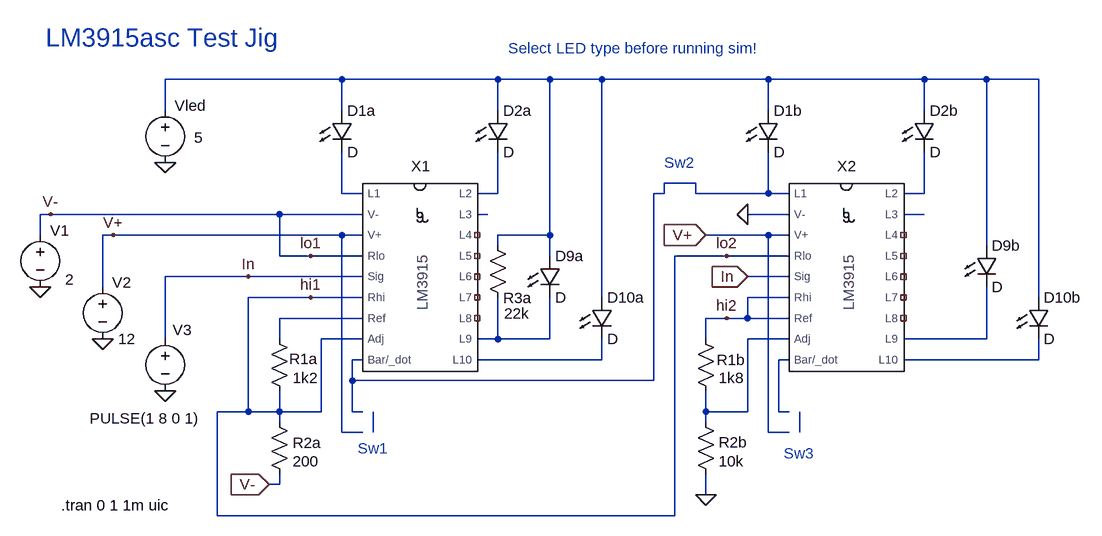
[diagram p0: schematic LM3915asc_Test.asc]
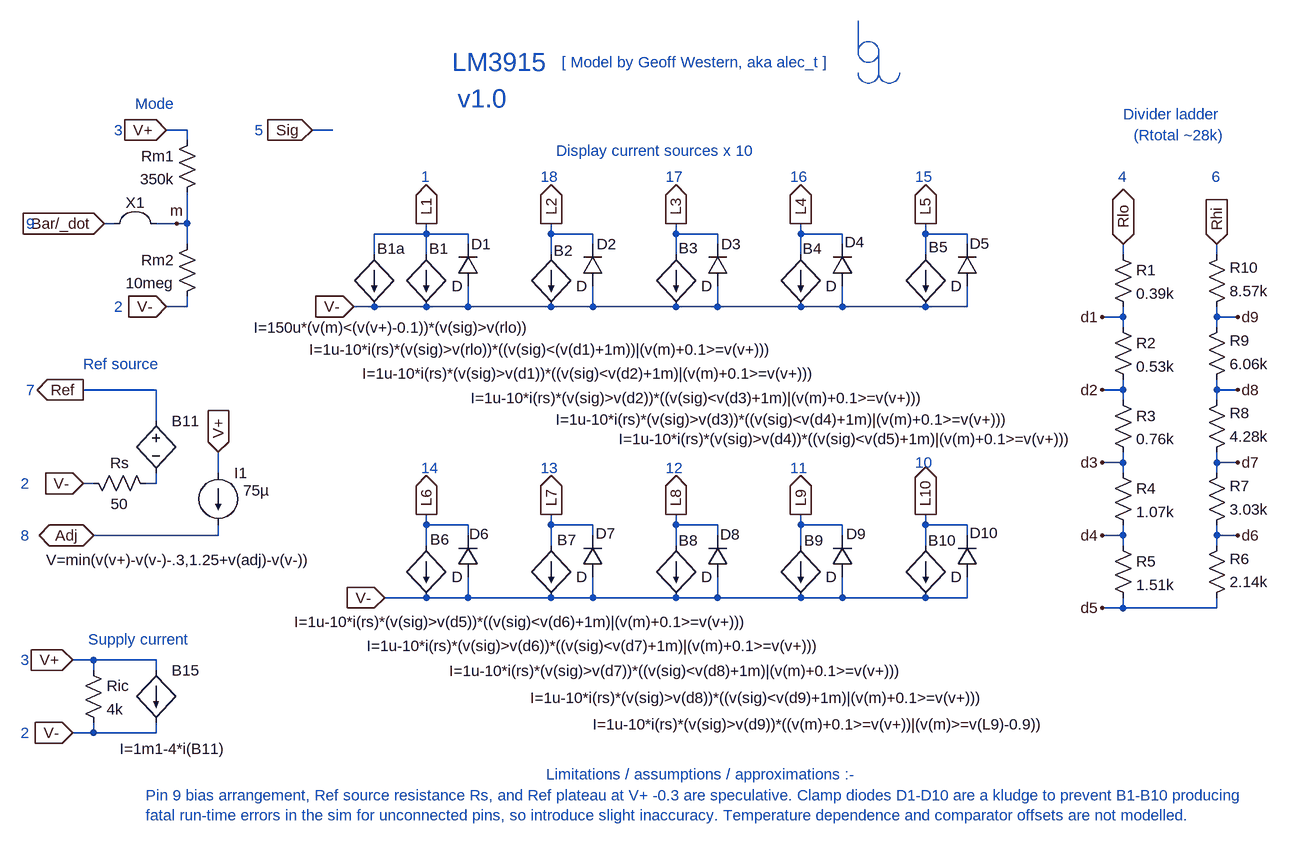
[diagram p1: sub-circuit lm3915asc.asc]
LM3915asc_Test.asc, the LTspice schematic file:
Version 4
SHEET 1 1496 692
WIRE 240 -112 -32 -112
WIRE 480 -112 240 -112
WIRE 560 -112 480 -112
WIRE 640 -112 560 -112
WIRE 896 -112 640 -112
WIRE 1136 -112 896 -112
WIRE 1232 -112 1136 -112
WIRE 1312 -112 1232 -112
WIRE -32 -64 -32 -112
WIRE 240 -64 240 -112
WIRE 480 -64 480 -112
WIRE 896 -64 896 -112
WIRE 1136 -64 1136 -112
WIRE 784 48 736 48
WIRE 240 64 240 0
WIRE 272 64 240 64
WIRE 480 64 480 0
WIRE 480 64 448 64
WIRE 736 64 736 48
WIRE 736 64 720 64
WIRE 784 64 784 48
WIRE 896 64 896 0
WIRE 896 64 784 64
WIRE 928 64 896 64
WIRE 1136 64 1136 0
WIRE 1136 64 1104 64
WIRE -208 96 -224 96
WIRE 144 96 -208 96
WIRE 272 96 144 96
WIRE 464 96 448 96
WIRE 928 96 864 96
WIRE 1136 96 1104 96
WIRE -224 128 -224 96
WIRE -112 128 -128 128
WIRE 240 128 -112 128
WIRE 272 128 240 128
WIRE 560 128 560 -112
WIRE 560 128 480 128
WIRE 896 128 800 128
WIRE 928 128 896 128
WIRE 480 144 480 128
WIRE 1232 144 1232 -112
WIRE 144 160 144 96
WIRE 192 160 144 160
WIRE 272 160 192 160
WIRE 560 160 560 128
WIRE 832 160 752 160
WIRE 928 160 832 160
WIRE 96 192 -32 192
WIRE 272 192 96 192
WIRE 928 192 864 192
WIRE -128 208 -128 128
WIRE 192 224 96 224
WIRE 272 224 192 224
WIRE 640 224 640 -112
WIRE 928 224 864 224
WIRE 1312 224 1312 -112
WIRE 272 256 144 256
WIRE 832 256 800 256
WIRE 864 256 864 224
WIRE 864 256 832 256
WIRE 928 256 864 256
WIRE -32 288 -32 192
WIRE 144 288 144 256
WIRE 272 288 208 288
WIRE 480 288 480 224
WIRE 480 288 448 288
WIRE 560 288 560 224
WIRE 560 288 480 288
WIRE 800 288 800 256
WIRE 928 288 864 288
WIRE 1232 288 1232 208
WIRE 1232 288 1104 288
WIRE 272 320 256 320
WIRE 640 320 640 288
WIRE 640 320 448 320
WIRE 928 320 912 320
WIRE 1312 320 1312 288
WIRE 1312 320 1104 320
WIRE 256 352 256 320
WIRE 720 352 720 64
WIRE 720 352 256 352
WIRE 96 400 96 224
WIRE 96 400 48 400
WIRE 144 400 144 368
WIRE 144 400 96 400
WIRE 208 400 208 288
WIRE 208 400 144 400
WIRE 256 400 256 352
WIRE 272 400 256 400
WIRE 800 400 800 368
WIRE 864 400 864 288
WIRE 864 400 800 400
WIRE 912 400 912 320
WIRE 928 400 912 400
WIRE 144 416 144 400
WIRE 800 416 800 400
WIRE 240 432 240 128
WIRE 272 432 240 432
WIRE 288 432 288 400
WIRE 896 432 896 128
WIRE 928 432 896 432
WIRE 944 432 944 400
WIRE 144 512 144 496
WIRE 144 512 128 512
WIRE 800 528 800 496
WIRE 48 560 48 400
WIRE 752 560 752 160
WIRE 752 560 48 560
FLAG -128 288 0
FLAG -32 368 0
FLAG 96 192 In
FLAG 192 224 hi1
FLAG 192 160 lo1
FLAG -224 208 0
FLAG -112 128 V+
FLAG 864 192 In
IOPIN 864 192 In
FLAG 832 256 hi2
FLAG -208 96 V-
FLAG 128 512 V-
IOPIN 128 512 In
FLAG 832 160 lo2
FLAG 864 96 0
FLAG 800 528 0
FLAG -32 16 0
FLAG 800 128 V+
IOPIN 800 128 In
SYMBOL voltage -128 192 R0
WINDOW 123 0 0 Left 2
WINDOW 39 0 0 Left 2
WINDOW 0 15 9 Left 2
SYMATTR InstName V2
SYMATTR Value 12
SYMBOL voltage -32 272 R0
WINDOW 3 -116 138 Left 2
WINDOW 123 0 0 Left 2
WINDOW 39 0 0 Left 2
WINDOW 0 12 2 Left 2
SYMATTR Value PULSE(1 8 0 1)
SYMATTR InstName V3
SYMBOL res 128 272 R0
WINDOW 0 31 47 Left 2
SYMATTR InstName R1a
SYMATTR Value 1k2
SYMBOL res 128 400 R0
WINDOW 0 36 48 Left 2
SYMATTR InstName R2a
SYMATTR Value 200
SYMBOL voltage -224 112 R0
WINDOW 123 0 0 Left 2
WINDOW 39 0 0 Left 2
WINDOW 0 15 9 Left 2
WINDOW 3 38 84 Left 2
SYMATTR InstName V1
SYMATTR Value 2
SYMBOL res 464 128 R0
WINDOW 0 24 97 Left 2
WINDOW 3 26 121 Left 2
SYMATTR InstName R3a
SYMATTR Value 22k
SYMBOL res 784 272 R0
WINDOW 0 33 48 Left 2
SYMATTR InstName R1b
SYMATTR Value 1k8
SYMBOL res 784 400 R0
WINDOW 0 36 47 Left 2
SYMATTR InstName R2b
SYMATTR Value 10k
SYMBOL voltage -32 -80 R0
WINDOW 123 0 0 Left 2
WINDOW 39 0 0 Left 2
WINDOW 0 15 9 Left 2
WINDOW 3 45 58 Left 2
SYMATTR InstName Vled
SYMATTR Value 5
SYMBOL LM3915asc 368 256 R0
SYMATTR InstName X1
SYMBOL LM3915asc 1024 256 R0
SYMATTR InstName X2
SYMBOL LED 224 -64 R0
SYMATTR InstName D1a
SYMBOL LED 464 -64 R0
SYMATTR InstName D2a
SYMBOL LED 544 160 R0
SYMATTR InstName D9a
SYMBOL LED 880 -64 R0
SYMATTR InstName D1b
SYMBOL LED 1120 -64 R0
SYMATTR InstName D2b
SYMBOL LED 1216 144 R0
SYMATTR InstName D9b
SYMBOL LED 1296 224 R0
SYMATTR InstName D10b
SYMBOL LED 624 224 R0
SYMATTR InstName D10a
TEXT -192 544 Left 2 !.tran 0 1 1m uic
TEXT -216 -176 Left 4 ;LM3915asc Test Jig
TEXT 264 456 Left 2 ;Sw1
TEXT 736 16 Left 2 ;Sw2
TEXT 920 464 Left 2 ;Sw3
TEXT 496 -160 Left 2 ;Select LED type before running sim!

lm3915asc.asc, the sub-circuit schematic file:
Version 4
SHEET 1 1684 1036
WIRE -480 -240 -512 -240
WIRE -256 -240 -288 -240
WIRE -480 -224 -480 -240
WIRE -592 -96 -608 -96
WIRE -496 -96 -528 -96
WIRE -480 -96 -480 -144
WIRE -480 -96 -496 -96
WIRE -112 -80 -112 -96
WIRE -112 -80 -192 -80
WIRE -48 -80 -112 -80
WIRE 80 -80 80 -96
WIRE 144 -80 80 -80
WIRE 272 -80 272 -96
WIRE 336 -80 272 -80
WIRE 464 -80 464 -96
WIRE 528 -80 464 -80
WIRE 656 -80 656 -96
WIRE 720 -80 656 -80
WIRE -480 -64 -480 -96
WIRE -48 -64 -48 -80
WIRE 144 -64 144 -80
WIRE 336 -64 336 -80
WIRE 528 -64 528 -80
WIRE 720 -64 720 -80
WIRE -192 -48 -192 -80
WIRE -112 -48 -112 -80
WIRE 80 -48 80 -80
WIRE 272 -48 272 -80
WIRE 464 -48 464 -80
WIRE 656 -48 656 -80
WIRE 960 -48 960 -64
WIRE 1104 -48 1104 -64
WIRE -480 32 -480 16
WIRE -480 32 -512 32
WIRE -192 32 -224 32
WIRE -112 32 -192 32
WIRE -48 32 -48 0
WIRE -48 32 -112 32
WIRE 80 32 -48 32
WIRE 144 32 144 0
WIRE 144 32 80 32
WIRE 272 32 144 32
WIRE 336 32 336 0
WIRE 336 32 272 32
WIRE 464 32 336 32
WIRE 528 32 528 0
WIRE 528 32 464 32
WIRE 656 32 528 32
WIRE 720 32 720 0
WIRE 720 32 656 32
WIRE 960 48 960 32
WIRE 960 48 928 48
WIRE 1104 48 1104 32
WIRE 1136 48 1104 48
WIRE 960 64 960 48
WIRE 1104 64 1104 48
WIRE -528 160 -640 160
WIRE 960 160 960 144
WIRE 960 160 928 160
WIRE 1104 160 1104 144
WIRE 1136 160 1104 160
WIRE 960 176 960 160
WIRE 1104 176 1104 160
WIRE -528 208 -528 160
WIRE 960 272 960 256
WIRE 960 272 928 272
WIRE 1104 272 1104 256
WIRE 1136 272 1104 272
WIRE -432 288 -432 256
WIRE 960 288 960 272
WIRE 1104 288 1104 272
WIRE -624 304 -640 304
WIRE -528 304 -528 288
WIRE -528 304 -544 304
WIRE -112 368 -112 352
WIRE -48 368 -112 368
WIRE 80 368 80 352
WIRE 144 368 80 368
WIRE 272 368 272 352
WIRE 336 368 272 368
WIRE 464 368 464 352
WIRE 528 368 464 368
WIRE 656 368 656 352
WIRE 720 368 656 368
WIRE -432 384 -432 368
WIRE -432 384 -624 384
WIRE -48 384 -48 368
WIRE 144 384 144 368
WIRE 336 384 336 368
WIRE 528 384 528 368
WIRE 720 384 720 368
WIRE 960 384 960 368
WIRE 960 384 928 384
WIRE 1104 384 1104 368
WIRE 1136 384 1104 384
WIRE -112 400 -112 368
WIRE 80 400 80 368
WIRE 272 400 272 368
WIRE 464 400 464 368
WIRE 656 400 656 368
WIRE 960 400 960 384
WIRE 1104 400 1104 384
WIRE -112 480 -176 480
WIRE -48 480 -48 448
WIRE -48 480 -112 480
WIRE 80 480 -48 480
WIRE 144 480 144 448
WIRE 144 480 80 480
WIRE 272 480 144 480
WIRE 336 480 336 448
WIRE 336 480 272 480
WIRE 464 480 336 480
WIRE 528 480 528 448
WIRE 528 480 464 480
WIRE 656 480 528 480
WIRE 720 480 720 448
WIRE 720 480 656 480
WIRE 960 496 960 480
WIRE 960 496 928 496
WIRE 1104 496 1104 480
WIRE 1104 496 960 496
WIRE -624 576 -656 576
WIRE -528 576 -624 576
WIRE -624 592 -624 576
WIRE -528 592 -528 576
WIRE -624 688 -624 672
WIRE -624 688 -656 688
WIRE -528 688 -528 672
WIRE -528 688 -624 688
FLAG -288 -240 Sig
IOPIN -288 -240 In
FLAG 960 -64 Rlo
IOPIN 960 -64 BiDir
FLAG -112 -96 L1
IOPIN -112 -96 Out
FLAG -224 32 V-
IOPIN -224 32 In
FLAG 80 -96 L2
IOPIN 80 -96 Out
FLAG 272 -96 L3
IOPIN 272 -96 Out
FLAG 464 -96 L4
IOPIN 464 -96 Out
FLAG 656 -96 L5
IOPIN 656 -96 Out
FLAG -112 352 L6
IOPIN -112 352 Out
FLAG 80 352 L7
IOPIN 80 352 Out
FLAG 272 352 L8
IOPIN 272 352 Out
FLAG 464 352 L9
IOPIN 464 352 Out
FLAG 656 352 L10
IOPIN 656 352 Out
FLAG -640 160 Ref
IOPIN -640 160 Out
FLAG 1104 -64 Rhi
IOPIN 1104 -64 In
FLAG -608 -96 Bar/_dot
IOPIN -608 -96 In
FLAG -656 576 V+
IOPIN -656 576 In
FLAG -176 480 V-
IOPIN -176 480 In
FLAG -656 688 V-
IOPIN -656 688 In
FLAG -624 384 Adj
IOPIN -624 384 BiDir
FLAG -432 256 V+
IOPIN -432 256 In
FLAG -640 304 V-
IOPIN -640 304 In
FLAG -496 -96 m
FLAG -512 -240 V+
IOPIN -512 -240 In
FLAG -512 32 V-
IOPIN -512 32 In
FLAG 928 48 d1
FLAG 928 160 d2
FLAG 928 272 d3
FLAG 928 384 d4
FLAG 928 496 d5
FLAG 1136 384 d6
FLAG 1136 272 d7
FLAG 1136 160 d8
FLAG 1136 48 d9
SYMBOL bi -112 -48 R0
WINDOW 3 -180 146 Left 2
WINDOW 0 4 -9 Left 2
SYMATTR Value I=1u-10*i(rs)*(v(sig)>v(rlo))*((v(sig)<(v(d1)+1m))|(v(m)+0.1>=v(v+)))
SYMATTR InstName B1
SYMBOL bi 80 -48 R0
WINDOW 3 -291 183 Left 2
WINDOW 0 4 -6 Left 2
SYMATTR Value I=1u-10*i(rs)*(v(sig)>v(d1))*((v(sig)<v(d2)+1m)|(v(m)+0.1>=v(v+)))
SYMATTR InstName B2
SYMBOL bi 272 -48 R0
WINDOW 3 -316 221 Left 2
WINDOW 0 4 -10 Left 2
SYMATTR Value I=1u-10*i(rs)*(v(sig)>v(d2))*((v(sig)<v(d3)+1m)|(v(m)+0.1>=v(v+)))
SYMATTR InstName B3
SYMBOL bi 464 -48 R0
WINDOW 3 -377 254 Left 2
WINDOW 0 3 -9 Left 2
SYMATTR Value I=1u-10*i(rs)*(v(sig)>v(d3))*((v(sig)<v(d4)+1m)|(v(m)+0.1>=v(v+)))
SYMATTR InstName B4
SYMBOL bi 656 -48 R0
WINDOW 3 -472 284 Left 2
WINDOW 0 5 -12 Left 2
SYMATTR Value I=1u-10*i(rs)*(v(sig)>v(d4))*((v(sig)<v(d5)+1m)|(v(m)+0.1>=v(v+)))
SYMATTR InstName B5
SYMBOL bi -112 400 R0
WINDOW 3 -203 117 Left 2
WINDOW 0 6 -10 Left 2
SYMATTR Value I=1u-10*i(rs)*(v(sig)>v(d5))*((v(sig)<v(d6)+1m)|(v(m)+0.1>=v(v+)))
SYMATTR InstName B6
SYMBOL bi 80 400 R0
WINDOW 3 -284 154 Left 2
WINDOW 0 9 -9 Left 2
SYMATTR Value I=1u-10*i(rs)*(v(sig)>v(d6))*((v(sig)<v(d7)+1m)|(v(m)+0.1>=v(v+)))
SYMATTR InstName B7
SYMBOL bi 272 400 R0
WINDOW 3 -349 193 Left 2
WINDOW 0 4 -8 Left 2
SYMATTR Value I=1u-10*i(rs)*(v(sig)>v(d7))*((v(sig)<v(d8)+1m)|(v(m)+0.1>=v(v+)))
SYMATTR InstName B8
SYMBOL bi 464 400 R0
WINDOW 3 -416 234 Left 2
WINDOW 0 5 -8 Left 2
SYMATTR Value I=1u-10*i(rs)*(v(sig)>v(d8))*((v(sig)<v(d9)+1m)|(v(m)+0.1>=v(v+)))
SYMATTR InstName B9
SYMBOL bi 656 400 R0
WINDOW 3 -512 275 Left 2
WINDOW 0 4 -8 Left 2
SYMATTR Value I=1u-10*i(rs)*(v(sig)>v(d9))*((v(m)+0.1>=v(v+))|(v(m)>=v(L9)-0.9))
SYMATTR InstName B10
SYMBOL res -640 576 R0
SYMATTR InstName Ric
SYMATTR Value 4k
SYMBOL diode -32 0 R180
WINDOW 0 -20 64 Left 2
WINDOW 3 24 0 Left 2
SYMATTR InstName D1
SYMBOL diode 160 0 R180
WINDOW 0 -21 64 Left 2
WINDOW 3 24 0 Left 2
SYMATTR InstName D2
SYMBOL diode 352 0 R180
WINDOW 0 -20 64 Left 2
WINDOW 3 24 0 Left 2
SYMATTR InstName D3
SYMBOL diode 544 0 R180
WINDOW 0 -18 67 Left 2
WINDOW 3 24 0 Left 2
SYMATTR InstName D4
SYMBOL diode 736 0 R180
WINDOW 0 -19 65 Left 2
WINDOW 3 24 0 Left 2
SYMATTR InstName D5
SYMBOL diode -32 448 R180
WINDOW 0 -17 66 Left 2
WINDOW 3 24 0 Left 2
SYMATTR InstName D6
SYMBOL diode 160 448 R180
WINDOW 0 -19 67 Left 2
WINDOW 3 24 0 Left 2
SYMATTR InstName D7
SYMBOL diode 352 448 R180
WINDOW 0 -19 65 Left 2
WINDOW 3 24 0 Left 2
SYMATTR InstName D8
SYMBOL diode 544 448 R180
WINDOW 0 -21 66 Left 2
WINDOW 3 24 0 Left 2
SYMATTR InstName D9
SYMBOL diode 736 448 R180
WINDOW 0 -32 68 Left 2
WINDOW 3 24 0 Left 2
SYMATTR InstName D10
SYMBOL res -464 -80 M0
SYMATTR InstName Rm2
SYMATTR Value 10meg
SYMBOL current -432 288 R0
WINDOW 123 0 0 Left 2
WINDOW 39 0 0 Left 2
WINDOW 3 38 27 Left 2
SYMATTR Value 75µ
SYMATTR InstName I1
SYMBOL res -528 320 M270
WINDOW 3 0 56 VBottom 2
WINDOW 0 32 56 VTop 2
SYMATTR Value 50
SYMATTR InstName Rs
SYMBOL bv -528 192 R0
WINDOW 3 -169 230 Left 2
SYMATTR Value V=min(v(v+)-v(v-)-.3,1.25+v(adj)-v(v-))
SYMATTR InstName B11
SYMBOL bi -192 -48 R0
WINDOW 3 -186 112 Left 2
WINDOW 0 4 -9 Left 2
SYMATTR Value I=150u*(v(m)<(v(v+)-0.1))*(v(sig)>v(rlo))
SYMATTR InstName B1a
SYMBOL bi -528 592 R0
WINDOW 3 -56 121 Left 2
SYMATTR Value I=1m1-4*i(B11)
SYMATTR InstName B15
SYMBOL res -464 -240 M0
SYMATTR InstName Rm1
SYMATTR Value 350k
SYMBOL res 944 -64 R0
SYMATTR InstName R1
SYMATTR Value 0.39k
SYMBOL res 944 48 R0
SYMATTR InstName R2
SYMATTR Value 0.53k
SYMBOL res 944 160 R0
SYMATTR InstName R3
SYMATTR Value 0.76k
SYMBOL res 944 272 R0
SYMATTR InstName R4
SYMATTR Value 1.07k
SYMBOL res 944 384 R0
SYMATTR InstName R5
SYMATTR Value 1.51k
SYMBOL res 1088 496 M180
WINDOW 0 36 76 Left 2
WINDOW 3 36 40 Left 2
SYMATTR InstName R6
SYMATTR Value 2.14k
SYMBOL res 1088 384 M180
WINDOW 0 36 76 Left 2
WINDOW 3 36 40 Left 2
SYMATTR InstName R7
SYMATTR Value 3.03k
SYMBOL res 1088 272 M180
WINDOW 0 36 76 Left 2
WINDOW 3 36 40 Left 2
SYMATTR InstName R8
SYMATTR Value 4.28k
SYMBOL res 1088 160 M180
WINDOW 0 36 76 Left 2
WINDOW 3 36 40 Left 2
SYMATTR InstName R9
SYMATTR Value 6.06k
SYMBOL res 1088 48 M180
WINDOW 0 36 76 Left 2
WINDOW 3 36 40 Left 2
SYMATTR InstName R10
SYMATTR Value 8.57k
SYMBOL Misc\\jumper -560 -160 R0
SYMATTR InstName X1
TEXT -736 576 Left 2 ;3
TEXT -728 -96 Left 2 ;9
TEXT -376 -240 Left 2 ;5
TEXT -728 160 Left 2 ;7
TEXT 1096 -168 Left 2 ;6
TEXT -736 384 Left 2 ;8
TEXT 952 -168 Left 2 ;4
TEXT -72 -344 Left 4 ;LM3915
TEXT -120 -168 Left 2 ;1
TEXT 64 -168 Left 2 ;18
TEXT 256 -168 Left 2 ;17
TEXT 448 -168 Left 2 ;16
TEXT 640 -168 Left 2 ;15
TEXT -120 280 Left 2 ;14
TEXT 64 280 Left 2 ;13
TEXT 256 280 Left 2 ;12
TEXT 448 280 Left 2 ;11
TEXT 640 272 Left 2 ;10
TEXT -632 544 Left 2 ;Supply current
TEXT -736 688 Left 2 ;2
TEXT 72 752 Left 2 ;Limitations / assumptions / approximations :-
TEXT -736 304 Left 2 ;2
TEXT -544 784 Left 2 ;Pin 9 bias arrangement, Ref source resistance Rs, and Ref plateau at V+ -0.3 are speculative. Clamp diodes D1-D10 are a kludge to prevent B1-B10 producing\nfatal run-time errors in the sim for unconnected pins, so introduce slight inaccuracy. Temperature dependence and comparator offsets are not modelled.
TEXT 96 -344 Left 2 ;[ Model by Geoff Western, aka alec_t ]
TEXT -640 120 Left 2 ;Ref source
TEXT -560 -280 Left 2 ;Mode
TEXT 960 -264 Left 2 ;Divider ladder
TEXT 88 -208 Left 2 ;Display current sources x 10
TEXT -592 32 Left 2 ;2
TEXT -592 -240 Left 2 ;3
TEXT 976 -232 Left 2 ;(Rtotal ~28k)
TEXT -64 -288 Left 4 ;v1.0
LINE Normal 552 -408 552 -376
LINE Normal 552 -392 552 -360
LINE Normal 584 -360 584 -328
CIRCLE Normal 584 -344 552 -376
ARC Normal 552 -344 584 -312 554 -328 590 -328
ARC Normal 584 -344 616 -312 586 -328 622 -328

The netlist it stands for:
* LM3915asc_Test.asc
V2 V+ 0 12
V3 In 0 PULSE(1 8 0 1)
R1a N008 lo2 1k2
R2a lo2 V- 200
V1 V- 0 2
R3a N001 N009 22k
R1b hi2 N010 1k8
R2b N010 0 10k
Vled N001 0 5
XX1 N002 lo2 In V+ V- lo2 N003 N012 N004 N006 NC_01 NC_02 NC_03 NC_04 NC_05 N009 N008 V- lm3915asc
XX2 N013 hi2 In V+ 0 N010 N002 N014 N005 N007 NC_06 NC_07 NC_08 NC_09 NC_10 N011 hi2 lo2 lm3915asc
D1a N001 N003 D
D2a N001 N004 D
D9a N001 N009 D
D1b N001 N002 D
D2b N001 N005 D
D9b N001 N011 D
D10b N001 N014 D
D10a N001 N012 D

* block symbol definitions
.subckt lm3915asc Bar/_dot Rhi Sig V+ V- Adj L1 L10 L2 L3 L4 L5 L6 L7 L8 L9 Ref Rlo
B1 L1 V- I=1u-10*i(rs)*(v(sig)>v(rlo))*((v(sig)<(v(d1)+1m))|(v(m)+0.1>=v(v+)))
B2 L2 V- I=1u-10*i(rs)*(v(sig)>v(d1))*((v(sig)<v(d2)+1m)|(v(m)+0.1>=v(v+)))
B3 L3 V- I=1u-10*i(rs)*(v(sig)>v(d2))*((v(sig)<v(d3)+1m)|(v(m)+0.1>=v(v+)))
B4 L4 V- I=1u-10*i(rs)*(v(sig)>v(d3))*((v(sig)<v(d4)+1m)|(v(m)+0.1>=v(v+)))
B5 L5 V- I=1u-10*i(rs)*(v(sig)>v(d4))*((v(sig)<v(d5)+1m)|(v(m)+0.1>=v(v+)))
B6 L6 V- I=1u-10*i(rs)*(v(sig)>v(d5))*((v(sig)<v(d6)+1m)|(v(m)+0.1>=v(v+)))
B7 L7 V- I=1u-10*i(rs)*(v(sig)>v(d6))*((v(sig)<v(d7)+1m)|(v(m)+0.1>=v(v+)))
B8 L8 V- I=1u-10*i(rs)*(v(sig)>v(d7))*((v(sig)<v(d8)+1m)|(v(m)+0.1>=v(v+)))
B9 L9 V- I=1u-10*i(rs)*(v(sig)>v(d8))*((v(sig)<v(d9)+1m)|(v(m)+0.1>=v(v+)))
B10 L10 V- I=1u-10*i(rs)*(v(sig)>v(d9))*((v(m)+0.1>=v(v+))|(v(m)>=v(L9)-0.9))
Ric V+ V- 4k
D1 V- L1 D
D2 V- L2 D
D3 V- L3 D
D4 V- L4 D
D5 V- L5 D
D6 V- L6 D
D7 V- L7 D
D8 V- L8 D
D9 V- L9 D
D10 V- L10 D
Rm2 Bar/_dot V- 10meg
I1 V+ Adj 75µ
Rs N001 V- 50
B11 Ref N001 V=min(v(v+)-v(v-)-.3,1.25+v(adj)-v(v-))
B1a L1 V- I=150u*(v(m)<(v(v+)-0.1))*(v(sig)>v(rlo))
B15 V+ V- I=1m1-4*i(B11)
Rm1 V+ Bar/_dot 350k
R1 Rlo d1 0.39k
R2 d1 d2 0.53k
R3 d2 d3 0.76k
R4 d3 d4 1.07k
R5 d4 d5 1.51k
R6 d5 d6 2.14k
R7 d6 d7 3.03k
R8 d7 d8 4.28k
R9 d8 d9 6.06k
R10 d9 Rhi 8.57k
* 3
* 9
* 5
* 7
* 6
* 8
* 4
* LM3915
* 1
* 18
* 17
* 16
* 15
* 14
* 13
* 12
* 11
* 10
* Supply current
* 2
* Limitations / assumptions / approximations :-
* 2
* Pin 9 bias arrangement, Ref source resistance Rs, and Ref plateau at V+ -0.3 are speculative. Clamp diodes D1-D10 are a kludge to prevent B1-B10 producing
* fatal run-time errors in the sim for unconnected pins, so introduce slight inaccuracy. Temperature dependence and comparator offsets are not modelled.
* [ Model by Geoff Western, aka alec_t ]
* Ref source
* Mode
* Divider ladder
* Display current sources x 10
* 2
* 3
* (Rtotal ~28k)
* v1.0
.ends lm3915asc

.model D D
.lib standard.dio
.tran 0 1 1m uic
* LM3915asc Test Jig
* Sw1
* Sw2
* Sw3
* Select LED type before running sim!
.backanno
.end